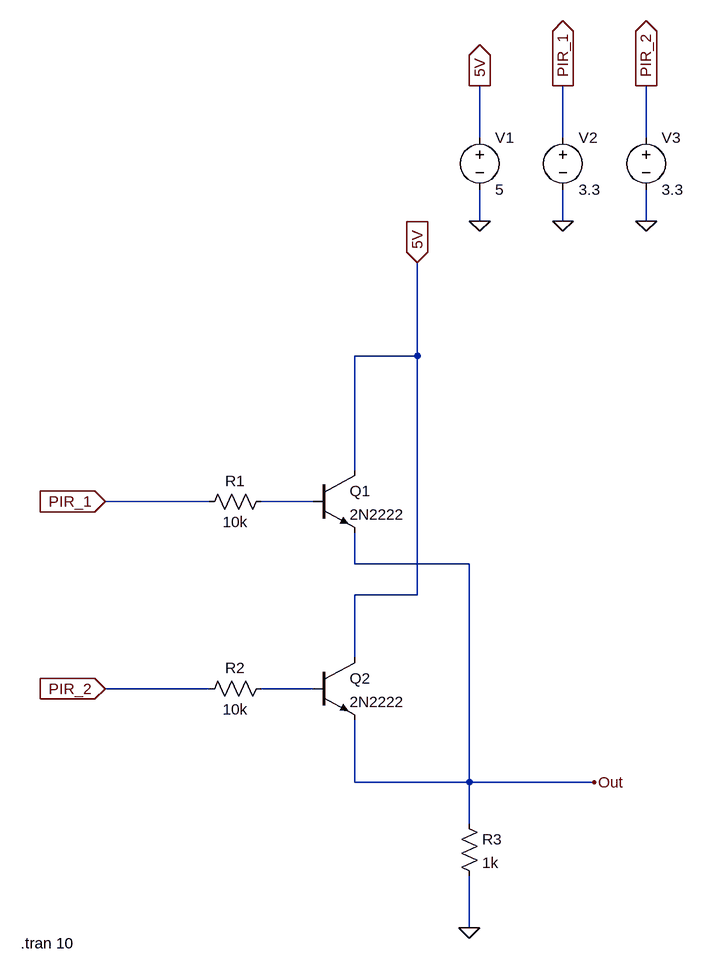
[diagram p0: schematic OR_gate_revision_1.asc]
OR_gate_revision_1.asc, the LTspice schematic file:
Version 4
SHEET 1 880 824
WIRE 288 -432 288 -512
WIRE 416 -432 416 -512
WIRE 544 -432 544 -512
WIRE 288 -304 288 -352
WIRE 416 -304 416 -352
WIRE 544 -304 544 -352
WIRE 192 -96 192 -240
WIRE 192 -96 96 -96
WIRE 96 80 96 -96
WIRE -128 128 -288 128
WIRE 32 128 -48 128
WIRE 96 224 96 176
WIRE 272 224 96 224
WIRE 192 272 192 -96
WIRE 192 272 96 272
WIRE 96 368 96 272
WIRE -128 416 -288 416
WIRE 32 416 -48 416
WIRE 96 560 96 464
WIRE 272 560 272 224
WIRE 272 560 96 560
WIRE 464 560 272 560
WIRE 272 624 272 560
WIRE 272 784 272 704
FLAG 288 -304 0
FLAG 288 -512 5V
IOPIN 288 -512 Out
FLAG 192 -240 5V
IOPIN 192 -240 In
FLAG 272 784 0
FLAG 464 560 Out
FLAG -288 128 PIR_1
IOPIN -288 128 In
FLAG -288 416 PIR_2
IOPIN -288 416 In
FLAG 416 -304 0
FLAG 416 -512 PIR_1
IOPIN 416 -512 Out
FLAG 544 -304 0
FLAG 544 -512 PIR_2
IOPIN 544 -512 Out
SYMBOL npn 32 80 R0
SYMATTR InstName Q1
SYMATTR Value 2N2222
SYMBOL npn 32 368 R0
SYMATTR InstName Q2
SYMATTR Value 2N2222
SYMBOL res -32 112 R90
WINDOW 0 0 56 VBottom 2
WINDOW 3 32 56 VTop 2
SYMATTR InstName R1
SYMATTR Value 10k
SYMBOL res -32 400 R90
WINDOW 0 0 56 VBottom 2
WINDOW 3 32 56 VTop 2
SYMATTR InstName R2
SYMATTR Value 10k
SYMBOL voltage 288 -448 R0
WINDOW 123 0 0 Left 0
WINDOW 39 0 0 Left 0
SYMATTR InstName V1
SYMATTR Value 5
SYMBOL res 256 608 R0
SYMATTR InstName R3
SYMATTR Value 1k
SYMBOL voltage 416 -448 R0
WINDOW 123 0 0 Left 0
WINDOW 39 0 0 Left 0
SYMATTR InstName V2
SYMATTR Value 3.3
SYMBOL voltage 544 -448 R0
WINDOW 123 0 0 Left 0
WINDOW 39 0 0 Left 0
SYMATTR InstName V3
SYMATTR Value 3.3
TEXT -418 808 Left 2 !.tran 10

The netlist it stands for:
* OR_gate_revision_1.asc
Q1 5V N001 Out 0 2N2222
Q2 5V N002 Out 0 2N2222
R1 N001 PIR_1 10k
R2 N002 PIR_2 10k
V1 5V 0 5
R3 Out 0 1k
V2 PIR_1 0 3.3
V3 PIR_2 0 3.3
.model NPN NPN
.model PNP PNP
.lib standard.bjt
.tran 10
.backanno
.end